# Altium project PCB_Project1.PrjPCB
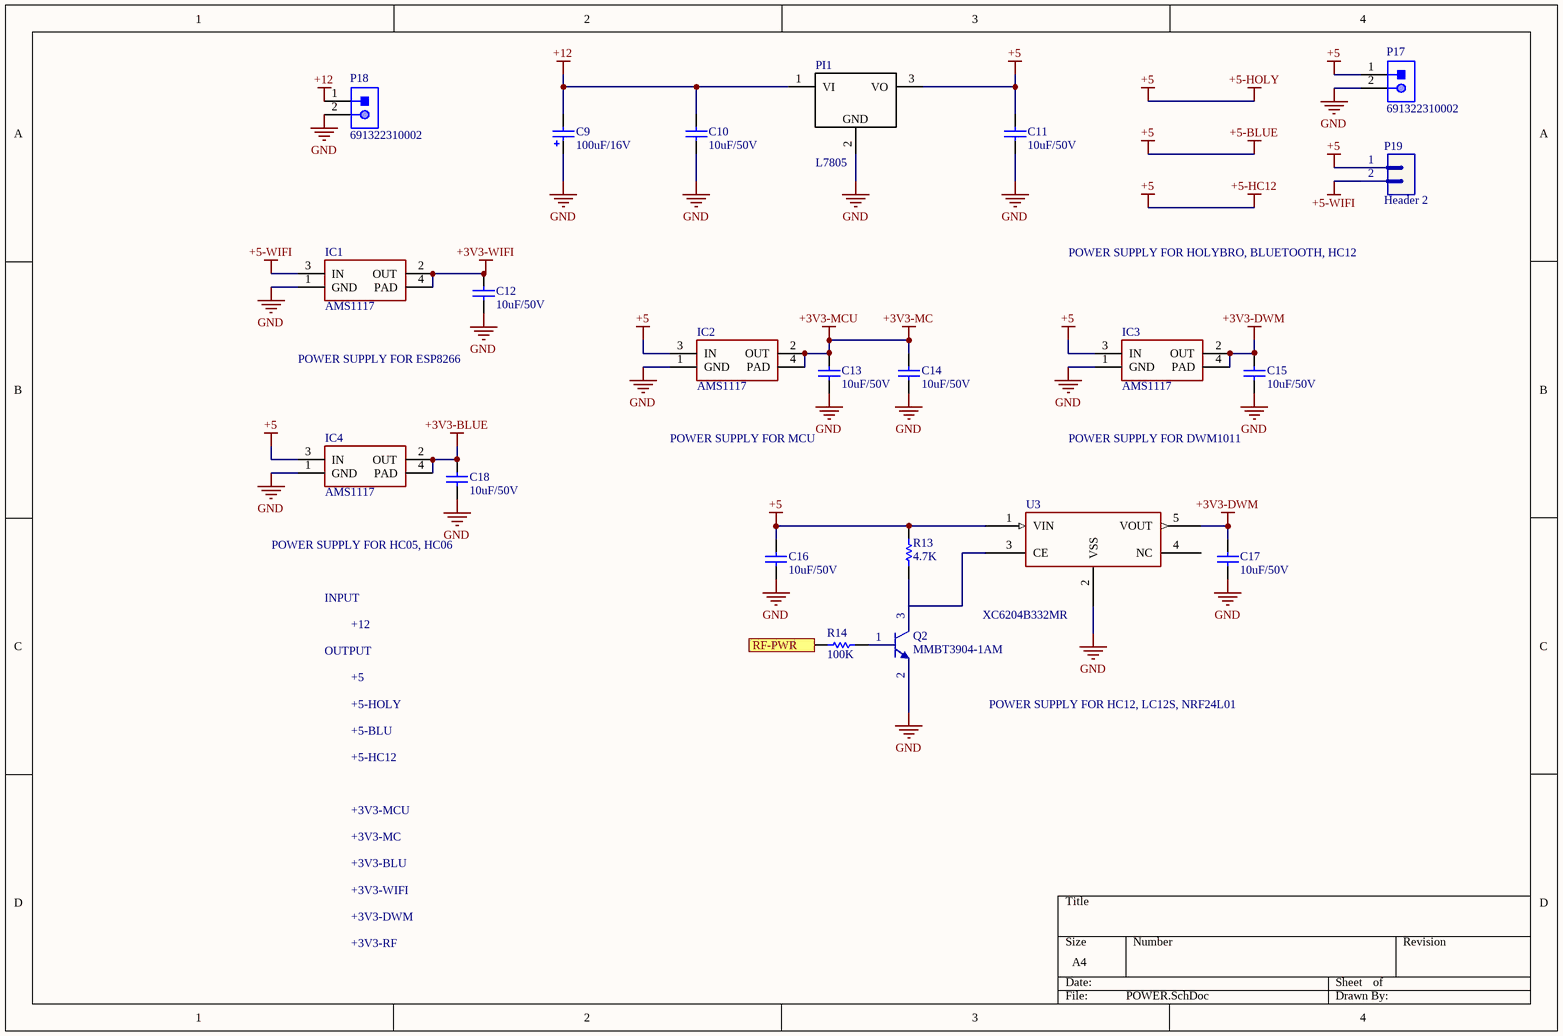
[diagram p0: POWER.SchDoc]
4 sheets, 76 parts. Net scope: flat (ports and power ports of the same name join across sheets).
Sheets:
  POWER.SchDoc
  MCU.SchDoc
  SENSOR.SchDoc
  MOTOR CONTROL.SchDoc

## Sheet POWER.SchDoc
size A4

### Parts
C9  value 100uF/16V  [CAP-SM-AL-SIZE-D-D6L6]  (hidden comment: Cap-Al-100uF-16V-D6L5)
C10  value 10uF/50V  [CAP-SM-0805]  (hidden comment: Cap-10uF-50V-0805)
C11  value 10uF/50V  [CAP-SM-0805]  (hidden comment: Cap-10uF-50V-0805)
C12  value 10uF/50V  [CAP-SM-0805]  (hidden comment: Cap-10uF-50V-0805)
C13  value 10uF/50V  [CAP-SM-0805]  (hidden comment: Cap-10uF-50V-0805)
C14  value 10uF/50V  [CAP-SM-0805]  (hidden comment: Cap-10uF-50V-0805)
C15  value 10uF/50V  [CAP-SM-0805]  (hidden comment: Cap-10uF-50V-0805)
C16  value 10uF/50V  [CAP-SM-0805]  (hidden comment: Cap-10uF-50V-0805)
C17  value 10uF/50V  [CAP-SM-0805]  (hidden comment: Cap-10uF-50V-0805)
C18  value 10uF/50V  [CAP-SM-0805]  (hidden comment: Cap-10uF-50V-0805)
IC1  AMS1117  [SOT223]
IC2  AMS1117  [SOT223]
IC3  AMS1117  [SOT223]
IC4  AMS1117  [SOT223]
P17  691322310002  [691322310002]
P18  691322310002  [691322310002]
P19  Header 2  [JP2]
PI1  L7805  [D2PAK]
Q2  MMBT3904-1AM  [SOT23_NEX]
R13  value 4.7K  [RES-SM-0805]  (hidden comment: Res-4.7K-0805)
R14  value 100K  [RES-SM-0805]  (hidden comment: Res-100K-0805)
U3  XC6204B332MR  [XC6204/05_SOT-00]

### Ports
RF-PWR (in)

### Nets
+3V3-BLUE: C18.2 IC4.2(OUT) IC4.4(PAD)
+3V3-DWM: C15.2 C17.2 IC3.2(OUT) IC3.4(PAD) U3.5(VOUT)
+3V3-MC: C13.2 C14.2 IC2.2(OUT) IC2.4(PAD)  [also labelled +3V3-MCU]
+3V3-WIFI: C12.2 IC1.2(OUT) IC1.4(PAD)
+5: C11.2 C16.2 IC2.3(IN) IC3.3(IN) IC4.3(IN) P17.1 P19.1 PI1.3(VO) R13.2 U3.1(VIN)  [also labelled +5-BLUE, +5-HC12, +5-HOLY]
+5-WIFI: IC1.3(IN) P19.2
+12: C9.2 C10.2 P18.1 PI1.1(VI)
GND: C9.1 C10.1 C11.1 C12.1 C13.1 C14.1 C15.1 C16.1 C17.1 C18.1 IC1.1(GND) IC2.1(GND) IC3.1(GND) IC4.1(GND) P17.2 P18.2 PI1.2 Q2.2(E) U3.2(VSS)
NetQ2_1: Q2.1(B) R14.2
NetQ2_3: Q2.3(C) R13.1
NetR14_1: R14.1 ; port RF-PWR

Not connected (* = marked no-connect by the designer): U3 3(CE) 4(NC)

### Notes on the sheet
- POWER SUPPLY FOR HOLYBRO, BLUETOOTH, HC12
- POWER SUPPLY FOR ESP8266
- POWER SUPPLY FOR MCU
- POWER SUPPLY FOR DWM1011
- POWER SUPPLY FOR HC05, HC06
- INPUT
- OUTPUT
- +12
- +5
- +5-HOLY
- POWER SUPPLY FOR HC12, LC12S, NRF24L01
- +5-BLU
- +5-HC12
- +3V3-MC
- +3V3-MCU
- +3V3-BLU
- +3V3-DWM
- +3V3-WIFI
- +3V3-RF
- (in symbol L7805-D2PAK) GND

### Library data of the parts
C9 = Cap-Al-100uF-16V-D6L5: CAP ALUM 100UF 20% 16V SMD; Manufacturer: Nichicon; Manufacturer Part Number: UWX1C101MCL1GB; Local Supplier: thegioiic; Local Supplier Link: https://thegioiic.com/products/tu-nhom-smd-100uf-16v-d6-3l5-4; Supplier 1: Digikey; Supplier 1 Part Number: 493-2105-1-ND; Supplier 1 Link: https://www.digikey.com/product-detail/en/nichicon/UWX1C101MCL1GB/493-2105-1-ND/590080
C10-C18 = Cap-10uF-50V-0805: CAP CER 10UF 50V X5R 0805; Manufacturer: Yageo; Manufacturer Part Number: CC0805KKX5R9BB106; Local Supplier: thegioiic; Local Supplier Link: https://thegioiic.com/products/tu-10uf-50v-0805; Supplier 1: Digikey; Supplier 1 Link: https://www.digikey.com/product-detail/en/yageo/CC0805KKX5R9BB106/311-3499-2-ND/7164383; Supplier 1 Part Number: 311-3499-2-ND
IC1-IC4 = AMS1117: Available in 1.8V, 2.5V, 2.85V, 3.3V, 5V, and  Adjustable Versions; Value: LM317
P17 P18 = 691322310002: WR-TBL Serie 322 Horizontal PCB Header, Pluggable, pitch 3.81mm, 2p; Compliance: RoHS; Modularity: No; Pin Number: 2; Rated Current [UL]: 10A; Working Voltage [UL]: 300VAC; ComponentLink1Description: Manufacturer; ComponentLink1URL: http://www.we-online.de; ComponentLink2URL: https://katalog.we-online.de/em/datasheet/691322310002.pdf; ComponentLink2Description: Datasheet; Mounting Technology: THT; Part Number: 691322310002; Packaging: Box; Operating Temperature: -40 to +105degC; PCB/Cable/Panel: PCB; Pitch: 3.81mm; Published Date: October 2019; Type: Horizontal; Publisher: Wurth Elektronik; Application: Pluggable
P19 = Header 2: Header, 2-Pin; LatestRevisionDate: 17-Jul-2002; LatestRevisionNote: Re-released for DXP Platform.; Publisher: Altium Limited
PI1 = L7805-D2PAK: LINEAR REGULATOR 5.0V; Supplier 1: Digi-Key; Supplier Part Number 1: 497-1170-6-ND
R13 = Res-4.7K-0805: RES SMD 4.7K OHM 5% 1/8W 0805; Manufacturer: Yageo; Manufacturer Part Number: RC0805JR-074K7L; Local Supplier: thegioiic; Local Supplier Link: https://thegioiic.com/products/dien-tro-4-7k-ohm-0805-5; Supplier 1: Digikey; Supplier 1 Link: https://www.digikey.com/product-detail/en/yageo/RC0805JR-074K7L/311-4.7KARCT-ND/731274; Supplier 1 Part Number: 311-4.7KARCT-ND
R14 = Res-100K-0805: RES 0 OHM JUMPER 0805; Manufacturer: Vishay Dale; Manufacturer Part Number: WSL080500000ZEA9; Local Supplier: thegioiic; Local Supplier Link: https://thegioiic.com/products/dien-tro-0-ohm-0805-5; Supplier 1: Digikey; Supplier 1 Link: https://www.digikey.com/product-detail/en/vishay-dale/WSL080500000ZEA9/541-3928-1-ND/7423223; Supplier 1 Part Number: 541-3928-1-ND
U3 = XC6204B332MR: Vendor: Torex Semiconductor; Built_By: EMA_UL_Team; SourceLibrary: Torex_2016-07-05_1; Manufacturer_Part_Number: XC6204B332MR; Copyright: Copyright (C) 2018 Accelerated Designs. All rights reserved; RefDes: RefDes; Type: DEV

## Sheet MCU.SchDoc
size A4
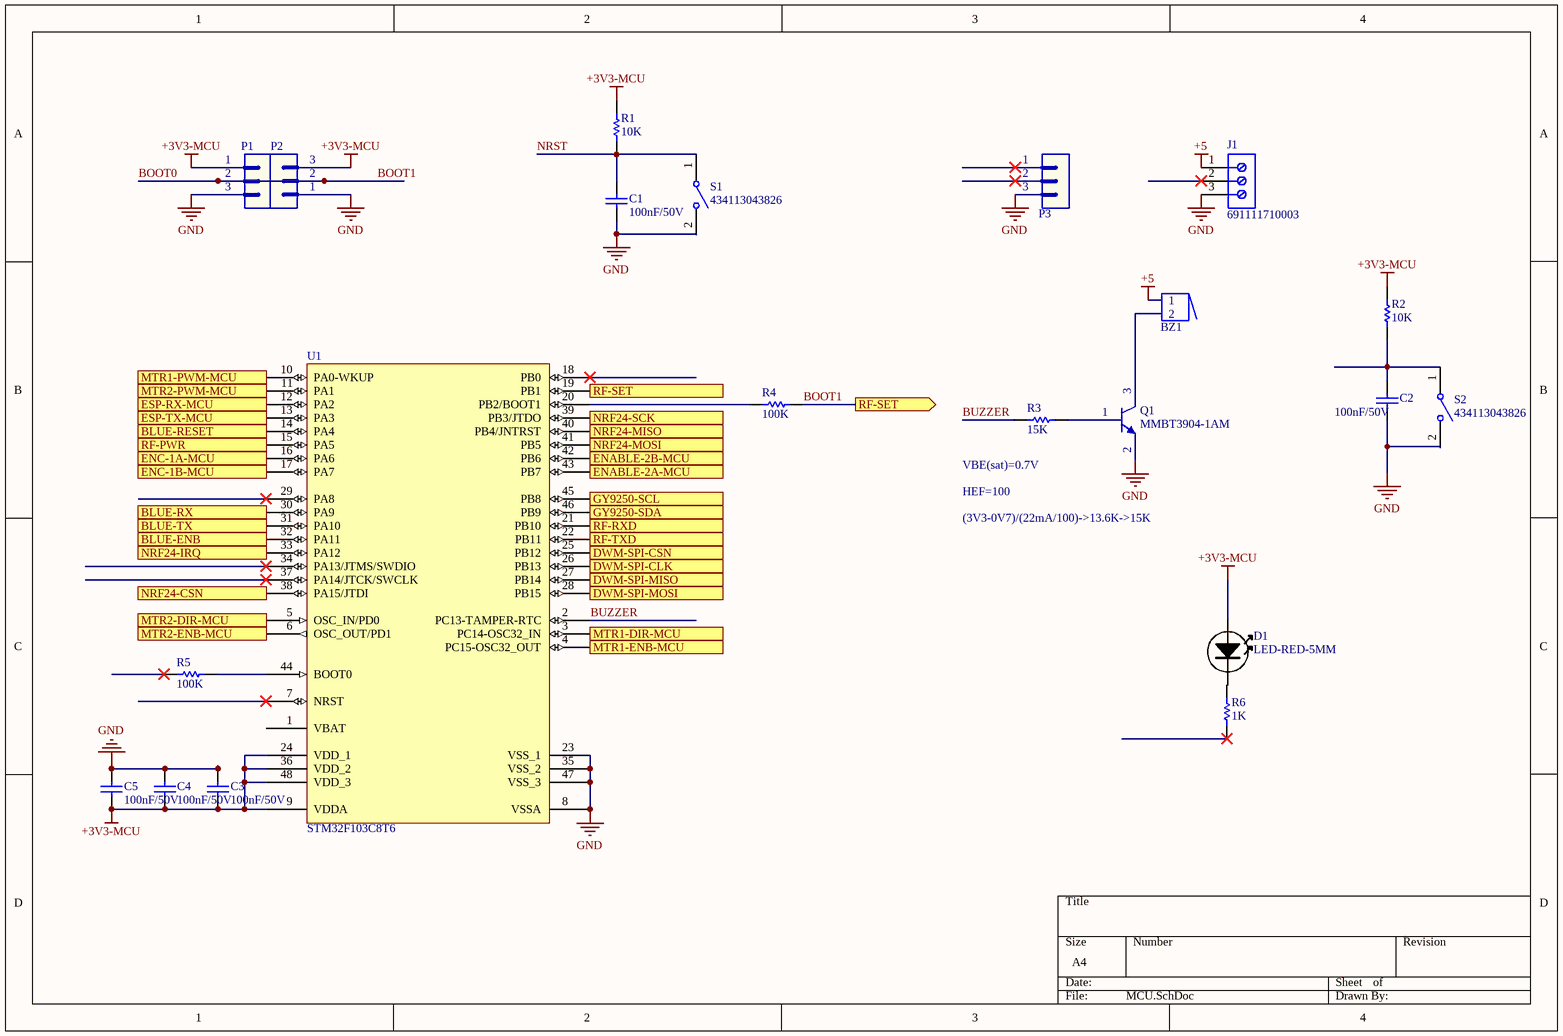
[diagram p1: MCU.SchDoc]

### Parts
BZ1  Buzzer  [BUZZER]  (value not drawn)
C1  value 100nF/50V  [CAP-SM-0805]  (hidden comment: Cap-100nF-50V-0805)
C2  value 100nF/50V  [CAP-SM-0805]  (hidden comment: Cap-100nF-50V-0805)
C3  value 100nF/50V  [CAP-SM-0805]  (hidden comment: Cap-100nF-50V-0805)
C4  value 100nF/50V  [CAP-SM-0805]  (hidden comment: Cap-100nF-50V-0805)
C5  value 100nF/50V  [CAP-SM-0805]  (hidden comment: Cap-100nF-50V-0805)
D1  LED-RED-5MM  [LED-5MM-RED]
J1  691111710003  [691111710003]
P1  Header 3  [JP3]  (value not drawn)
P2  Header 3  [JP3]  (value not drawn)
P3  Header 3  [JP3]  (value not drawn)
Q1  MMBT3904-1AM  [SOT23_NEX]
R1  value 10K  [RES-SM-0805]  (hidden comment: Res-10k-0805)
R2  value 10K  [RES-SM-0805]  (hidden comment: Res-10k-0805)
R3  value 15K  [RES-SM-0805]  (hidden comment: Res-15K-0805)
R4  value 100K  [RES-SM-0805]  (hidden comment: Res-100K-0805)
R5  value 100K  [RES-SM-0805]  (hidden comment: Res-100K-0805)
R6  value 1K  [RES-SM-0805]  (hidden comment: Res-1K-0805)
S1  434113043826  [434113043826]
S2  434113043826  [434113043826]
U1  STM32F103C8T6  [LQFP48_N]

### Ports
BLUE-ENB (out), BLUE-RESET (out), BLUE-RX (out), BLUE-TX (in), DWM-SPI-CLK (out), DWM-SPI-CSN (out), DWM-SPI-MISO (in), DWM-SPI-MOSI (out), ENABLE-2A-MCU (in), ENABLE-2B-MCU (in), ENC-1A-MCU (in), ENC-1B-MCU (in), ESP-RX-MCU (out), ESP-TX-MCU (in), GY9250-SCL (out), GY9250-SDA (out), MTR1-DIR-MCU (out), MTR1-ENB-MCU (out), MTR1-PWM-MCU (out), MTR2-DIR-MCU (out), MTR2-ENB-MCU (out), MTR2-PWM-MCU (out), NRF24-CSN (out), NRF24-IRQ (in), NRF24-MISO (in), NRF24-MOSI (out), NRF24-SCK (out), RF-PWR (out), RF-RXD (out), RF-SET (out), RF-TXD (in)

### Nets
+3V3-MCU: C3.1 C4.1 C5.1 D1.A P1.1 P2.3 R1.2 R2.2 U1.9(VDDA) U1.24(VDD_1) U1.36(VDD_2) U1.48(VDD_3)  [project net +3V3-MC]
+5: BZ1.1 J1.1
GND: C1.1 C2.2 C3.2 C4.2 C5.2 J1.3 P1.3 P2.1 P3.3 Q1.2(E) S1.2 S2.2 U1.8(VSSA) U1.23(VSS_1) U1.35(VSS_2) U1.47(VSS_3)
BOOT0: P1.2 P2.2 R4.2 U1.19(PB1) ; port RF-SET  [also labelled BOOT1]
BUZZER: R3.1 U1.2(PC13-TAMPER-RTC)
NRST: C1.2 R1.1 S1.1
NetBZ1_2: BZ1.2 Q1.3(C)
NetC2_1: C2.1 R2.1 S2.1
NetM3_3: U1.45(PB8) ; port GY9250-SCL
NetM3_4: U1.46(PB9) ; port GY9250-SDA
NetQ1_1: Q1.1(B) R3.2
NetR4_1: R4.1 U1.20(PB2/BOOT1)
NetR5_2: R5.2 U1.44(BOOT0)
NetR14_1: U1.15(PA5) ; port RF-PWR
NetU1_3: U1.3(PC14-OSC32_IN) ; port MTR1-DIR-MCU
NetU1_4: U1.4(PC15-OSC32_OUT) ; port MTR1-ENB-MCU
NetU1_5: U1.5(OSC_IN/PD0) ; port MTR2-DIR-MCU
NetU1_6: U1.6(OSC_OUT/PD1) ; port MTR2-ENB-MCU
NetU1_10: U1.10(PA0-WKUP) ; port MTR1-PWM-MCU
NetU1_11: U1.11(PA1) ; port MTR2-PWM-MCU
NetU1_12: U1.12(PA2) ; port ESP-RX-MCU
NetU1_13: U1.13(PA3) ; port ESP-TX-MCU
NetU1_14: U1.14(PA4) ; port BLUE-RESET
NetU1_16: U1.16(PA6) ; port ENC-1A-MCU
NetU1_17: U1.17(PA7) ; port ENC-1B-MCU
NetU1_21: U1.21(PB10) ; port RF-RXD
NetU1_22: U1.22(PB11) ; port RF-TXD
NetU1_25: U1.25(PB12) ; port DWM-SPI-CSN
NetU1_26: U1.26(PB13) ; port DWM-SPI-CLK
NetU1_27: U1.27(PB14) ; port DWM-SPI-MISO
NetU1_28: U1.28(PB15) ; port DWM-SPI-MOSI
NetU1_30: U1.30(PA9) ; port BLUE-RX
NetU1_31: U1.31(PA10) ; port BLUE-TX
NetU1_32: U1.32(PA11) ; port BLUE-ENB
NetU1_33: U1.33(PA12) ; port NRF24-IRQ
NetU1_38: U1.38(PA15/JTDI) ; port NRF24-CSN
NetU1_39: U1.39(PB3/JTDO) ; port NRF24-SCK
NetU1_40: U1.40(PB4/JNTRST) ; port NRF24-MISO
NetU1_41: U1.41(PB5) ; port NRF24-MOSI
NetU1_42: U1.42(PB6) ; port ENABLE-2B-MCU
NetU1_43: U1.43(PB7) ; port ENABLE-2A-MCU

Not connected (* = marked no-connect by the designer): D1 K; J1 2*; P3 1* 2*; R5 1*; R6 1* 2; U1 1(VBAT) 7(NRST)* 18(PB0)* 29(PA8)* 34(PA13/JTMS/SWDIO)* 37(PA14/JTCK/SWCLK)*

### Notes on the sheet
- (near R3) VBE(sat)=0.7V
- HEF=100
- (3V3-0V7)/(22mA/100)->13.6K->15K

### Library data of the parts
C1-C5 = Cap-100nF-50V-0805: CAP CER 0.1UF 50V Y5V 0805; Manufacturer: Samsung Electro-Mechanics; Manufacturer Part Number: CL21F104ZBCNNNC; Local Supplier: thegioiic; Local Supplier Link: https://thegioiic.com/products/tu-100nf-0-1uf-50v-0805; Supplier 1: Digikey; Supplier 1 Part Number: 1276-1007-1-ND; Supplier 1 Link: https://www.digikey.com/product-detail/en/samsung-electro-mechanics/CL21F104ZBCNNNC/1276-1007-1-ND/3889093
J1 = 691111710003: WR-TBL Serie 111 Horizontal Entry Modular, Pressure Clamp, pitch 5mm, 3p; Compliance: Lead free / RoHS; Modularity: Yes; PCB/Cable/Panel: PCB; Pin Number: 3; Rated Current [UL]: 15A; Working Voltage [UL]: 250VAC; ComponentLink1Description: Manufacturer; ComponentLink1URL: http://www.we-online.de; ComponentLink2URL: https://katalog.we-online.de/em/datasheet/691111710003.pdf; ComponentLink2Description: Datasheet; Mounting Technology: THT; Part Number: 691111710003; Packaging: Box; Operating Temperature: -40 to +105degC; Pitch: 5mm; Published Date: October 2019; Type: Horizontal; Publisher: Wurth Elektronik; Application: Pressure Clamp
P1-P3 = Header 3: Header, 3-Pin; LatestRevisionDate: 17-Jul-2002; LatestRevisionNote: Re-released for DXP Platform.; Publisher: Altium Limited
R1 R2 = Res-10k-0805: RES 10K OHM 1% 1/4W 0805; Manufacturer: Stackpole Electronics Inc; Manufacturer Part Number: RNCP0805FTD10K0; Local Supplier: thegioiic; Local Supplier Link: https://thegioiic.com/products/dien-tro-10k-ohm-0805-5; Supplier 1: Digikey; Supplier 1 Link: https://www.digikey.com/product-detail/en/stackpole-electronics-inc/RNCP0805FTD10K0/RNCP0805FTD10K0CT-ND/2240601; Supplier 1 Part Number: RNCP0805FTD10K0CT-ND
R3 = Res-15K-0805: RES 15K OHM 1% 1/4W 0805; Manufacturer: TE Connectivity Passive Product; Manufacturer Part Number: CRGCQ0805F15K; Local Supplier: thegioiic; Local Supplier Link: https://thegioiic.com/products/dien-tro-15k-ohm-0805-1; Supplier 1: Digikey; Supplier 1 Part Number: A129763CT-ND; Supplier 1 Link: https://www.digikey.com/product-detail/en/te-connectivity-passive-product/CRGCQ0805F15K/A129763CT-ND/8577595
R4 R5 = Res-100K-0805: as R14 on sheet POWER; Local Supplier: thegioiic; Local Supplier Link: https://thegioiic.com/products/dien-tro-0-ohm-0805-5; Supplier 1: Digikey; Supplier 1 Link: https://www.digikey.com/product-detail/en/vishay-dale/WSL080500000ZEA9/541-3928-1-ND/7423223; Supplier 1 Part Number: 541-3928-1-ND
R6 = Res-1K-0805: RES 1K OHM 1% 1/4W 0805; Manufacturer: Stackpole Electronics Inc; Manufacturer Part Number: RNCP0805FTD1K00; Local Supplier: thegioiic; Local Supplier Link: https://thegioiic.com/products/dien-tro-1k-ohm-0805-5; Supplier 1: Digikey; Supplier 1 Link: https://www.digikey.com/product-detail/en/stackpole-electronics-inc/RNCP0805FTD1K00/RNCP0805FTD1K00CT-ND/2240568; Supplier 1 Part Number: RNCP0805FTD1K00CT-ND
S1 S2 = 434113043826: WS-TASV J-Bend SMT Tact Switch 6x3.5mm, height 4.3mm, 260gf; Rated Voltage: 12VDC; Rated Current: 50mA; Washable: No; ComponentLink1Description: Manufacturer; ComponentLink1URL: http://www.we-online.de; ComponentLink2Description: Datasheet; ComponentLink2URL: https://katalog.we-online.com/em/datasheet/434113043826.pdf; Operating Temperature: -40 to +85degC; Part Number: 434113043826; Published Date: September 2019; Contact Material: Stainless Steel; Height: 4.3mm; Mounting Technology: SMT; Contact Plating: Silver; Operation Force: 260gf; Packaging: Tape and Reel; Terminal Material: Copper Alloy; Publisher: Wurth Elektronik; Terminal Plating: Silver
U1 = STM32F103C8T6: STM32 ARM-based 32-bit MCU with 64 Kbytes Flash, 48-pin LQFP, Industrial Temperature; Published: 30-May-2008; DatasheetVersion: rev6, Mar-2008; PackageVersion: Mar-2008; PackageReference: LQFP48; Publisher: Altium Limited; PackageDescription: 48-Pin Low-Profile Quad Flat Pack, 7 x 7 mm Body, 0.5 mm Pitch (LQFP48); ComponentLink1Description: Manufacturer Link; ComponentLink1URL: www.st.com/stm32; ComponentLink2Description: Datasheet; ComponentLink2URL: http://www.st.com/stonline/products/literature/ds/13587.pdf

## Sheet SENSOR.SchDoc
size A4
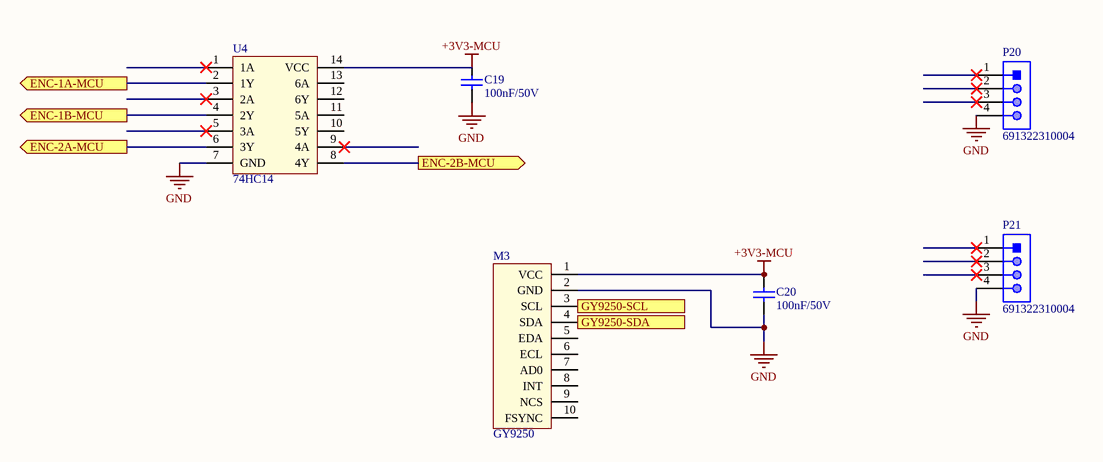
[diagram p2: SENSOR.SchDoc]

### Parts
C19  value 100nF/50V  [CAP-SM-0805]  (hidden comment: Cap-100nF-50V-0805)
C20  value 100nF/50V  [CAP-SM-0805]  (hidden comment: Cap-100nF-50V-0805)
M3  GY9250  [GY9250]
P20  691322310004  [691322310004]
P21  691322310004  [691322310004]
U4  74HC14  [74HC14D,652]

### Ports
ENC-1A-MCU (out), ENC-1B-MCU (out), ENC-2A-MCU (out), ENC-2B-MCU (out), GY9250-SCL, GY9250-SDA

### Nets
+3V3-MCU: C20.2 M3.1(VCC) U4.14(VCC)  [project net +3V3-MC]
GND: C19.1 C20.1 M3.2(GND) P20.4 P21.4 U4.7(GND)
NetM3_3: M3.3(SCL) ; port GY9250-SCL
NetM3_4: M3.4(SDA) ; port GY9250-SDA
NetU1_16: U4.2(1Y) ; port ENC-1A-MCU
NetU1_17: U4.4(2Y) ; port ENC-1B-MCU
NetU4_6: U4.6(3Y) ; port ENC-2A-MCU
NetU4_8: U4.8(4Y) ; port ENC-2B-MCU

Not connected (* = marked no-connect by the designer): C19 2; M3 5(EDA) 6(ECL) 7(AD0) 8(INT) 9(NCS) 10(FSYNC); P20 1* 2* 3*; P21 1* 2* 3*; U4 1(1A)* 3(2A)* 5(3A)* 9(4A)* 10(5Y) 11(5A) 12(6Y) 13(6A)

### Library data of the parts
C19 C20 = Cap-100nF-50V-0805: as C1 on sheet MCU; Local Supplier: thegioiic; Local Supplier Link: https://thegioiic.com/products/tu-100nf-0-1uf-50v-0805; Supplier 1: Digikey; Supplier 1 Part Number: 1276-1007-1-ND; Supplier 1 Link: https://www.digikey.com/product-detail/en/samsung-electro-mechanics/CL21F104ZBCNNNC/1276-1007-1-ND/3889093
P20 P21 = 691322310004: WR-TBL Serie 322 Horizontal PCB Header, Pluggable, pitch 3.81mm, 4p; Compliance: RoHS; Modularity: No; Pin Number: 4; Rated Current [UL]: 10A; Working Voltage [UL]: 300VAC; ComponentLink1Description: Manufacturer; ComponentLink1URL: http://www.we-online.de; ComponentLink2URL: https://katalog.we-online.de/em/datasheet/691322310004.pdf; ComponentLink2Description: Datasheet; Mounting Technology: THT; Part Number: 691322310004; Packaging: Box; Operating Temperature: -40 to +105degC; PCB/Cable/Panel: PCB; Pitch: 3.81mm; Published Date: October 2019; Type: Horizontal; Publisher: Wurth Elektronik; Application: Pluggable

## Sheet MOTOR CONTROL.SchDoc
size A4
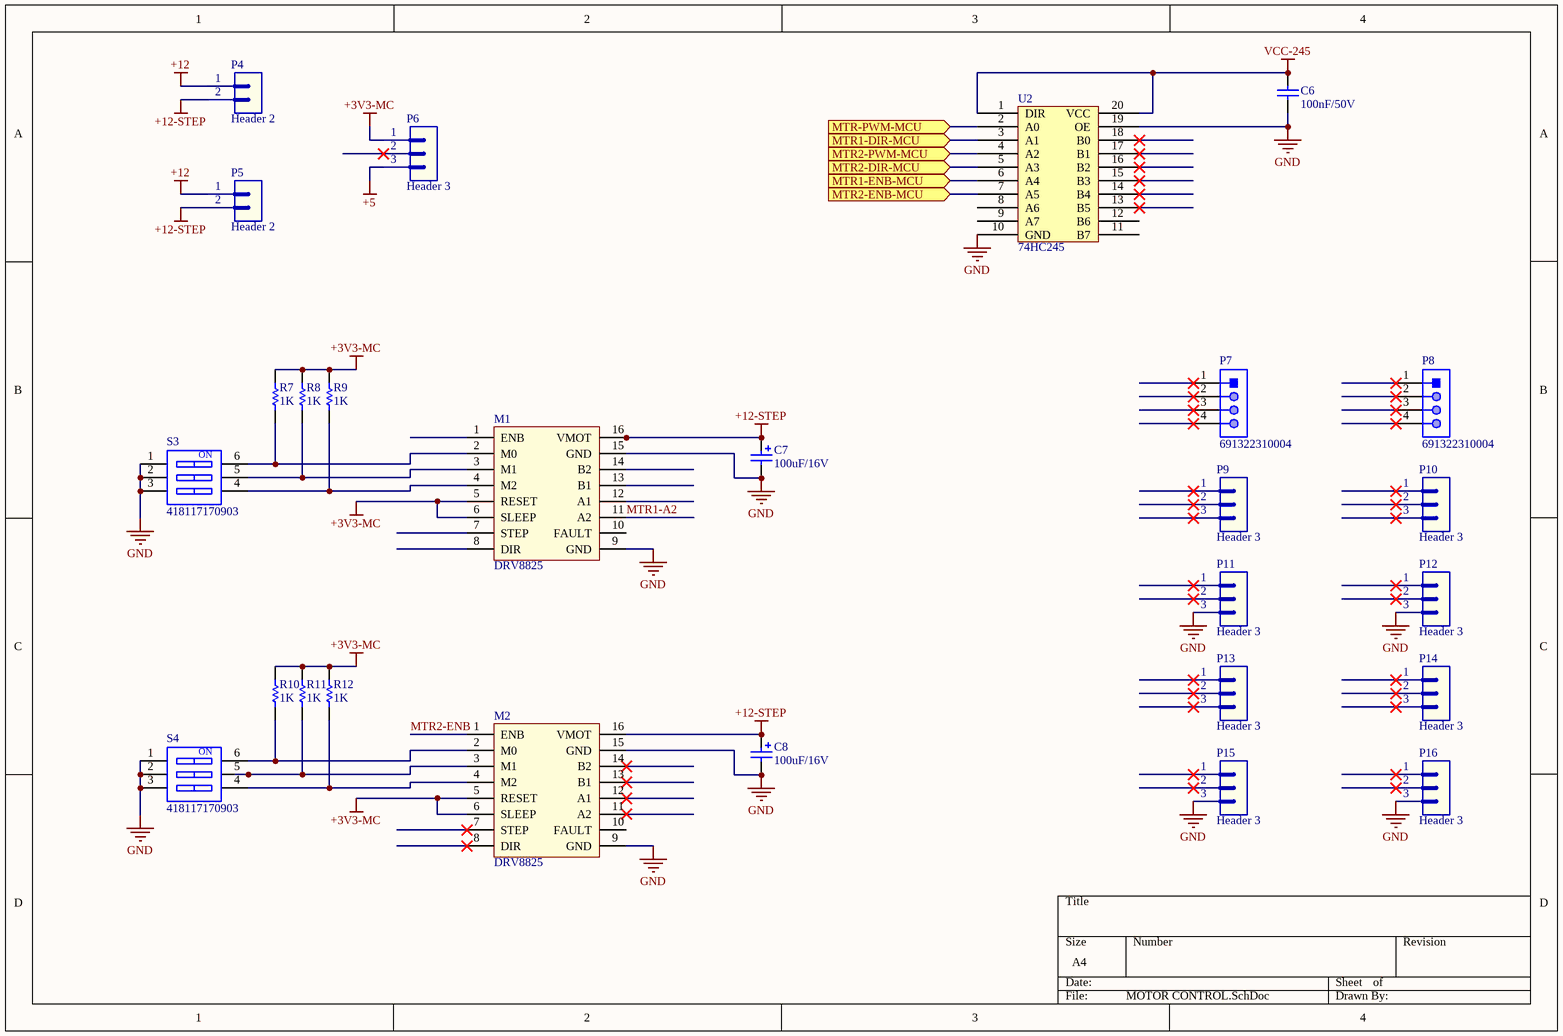
[diagram p3: MOTOR CONTROL.SchDoc]

### Parts
C6  value 100nF/50V  [CAP-SM-0805]  (hidden comment: Cap-100nF-50V-0805)
C7  value 100uF/16V  [CAP-SM-AL-SIZE-D-D6L6]  (hidden comment: Cap-Al-100uF-16V-D6L5)
C8  value 100uF/16V  [CAP-SM-AL-SIZE-D-D6L6]  (hidden comment: Cap-Al-100uF-16V-D6L5)
M1  DRV8825
M2  DRV8825
P4  Header 2  [JP2]
P5  Header 2  [JP2]
P6  Header 3  [JP3]
P7  691322310004  [691322310004]
P8  691322310004  [691322310004]
P9  Header 3  [JP3]
P10  Header 3  [JP3]
P11  Header 3  [JP3]
P12  Header 3  [JP3]
P13  Header 3  [JP3]
P14  Header 3  [JP3]
P15  Header 3  [JP3]
P16  Header 3  [JP3]
R7  value 1K  [RES-SM-0805]  (hidden comment: Res-1K-0805)
R8  value 1K  [RES-SM-0805]  (hidden comment: Res-1K-0805)
R9  value 1K  [RES-SM-0805]  (hidden comment: Res-1K-0805)
R10  value 1K  [RES-SM-0805]  (hidden comment: Res-1K-0805)
R11  value 1K  [RES-SM-0805]  (hidden comment: Res-1K-0805)
R12  value 1K  [RES-SM-0805]  (hidden comment: Res-1K-0805)
S3  418117170903  [418117170903]
S4  418117170903  [418117170903]
U2  74HC245  [DIP20/W0.3]

### Ports
MTR1-DIR-MCU (in), MTR1-ENB-MCU (in), MTR2-DIR-MCU (in), MTR2-ENB-MCU (in), MTR2-PWM-MCU (in), MTR-PWM-MCU (in)

### Nets
+3V3-MC: M1.5(RESET) M1.6(SLEEP) M2.5(RESET) M2.6(SLEEP) P6.1 R7.2 R8.2 R9.2 R10.2 R11.2 R12.2
+5: P6.3
+12: P4.1 P5.1
+12-STEP: C7.1 C8.1 M1.16(VMOT) M2.16(VMOT) P4.2 P5.2
GND: C6.1 C7.2 C8.2 M1.9(GND) M1.15(GND) M2.9(GND) M2.15(GND) P11.3 P12.3 P15.3 P16.3 S3.1 S3.2 S3.3 S4.1 S4.2 S4.3 U2.10(GND) U2.19(OE)
VCC-245: C6.2 U2.1(DIR) U2.20(VCC)
MTR1-A2: M1.11(A2)
MTR2-ENB: M2.1(ENB)
NetM1_2: M1.2(M0) R7.1 S3.6
NetM1_3: M1.3(M1) R8.1 S3.5
NetM1_4: M1.4(M2) R9.1 S3.4
NetM2_2: M2.2(M0) R10.1 S4.6
NetM2_3: M2.3(M1) R11.1 S4.5
NetM2_4: M2.4(M2) R12.1 S4.4
NetU1_3: U2.3(A1) ; port MTR1-DIR-MCU
NetU1_4: U2.6(A4) ; port MTR1-ENB-MCU
NetU1_5: U2.5(A3) ; port MTR2-DIR-MCU
NetU1_6: U2.7(A5) ; port MTR2-ENB-MCU
NetU1_11: U2.4(A2) ; port MTR2-PWM-MCU
NetU2_2: U2.2(A0) ; port MTR-PWM-MCU

Not connected (* = marked no-connect by the designer): M1 1(ENB) 7(STEP) 8(DIR) 10(FAULT) 12(A1) 13(B1) 14(B2); M2 7(STEP)* 8(DIR)* 10(FAULT) 11(A2)* 12(A1)* 13(B1)* 14(B2)*; P6 2*; P7 1* 2* 3* 4*; P8 1* 2* 3* 4*; P9 1* 2* 3*; P10 1* 2* 3*; P11 1* 2*; P12 1* 2*; P13 1* 2* 3*; P14 1* 2* 3*; P15 1* 2*; P16 1* 2*; U2 8(A6) 9(A7) 11(B7) 12(B6) 13(B5)* 14(B4)* 15(B3)* 16(B2)* 17(B1)* 18(B0)*

### Notes on the sheet
- (in symbol 418117170903) ON

### Library data of the parts
C6 = Cap-100nF-50V-0805: as C1 on sheet MCU; Local Supplier: thegioiic; Local Supplier Link: https://thegioiic.com/products/tu-100nf-0-1uf-50v-0805; Supplier 1: Digikey; Supplier 1 Part Number: 1276-1007-1-ND; Supplier 1 Link: https://www.digikey.com/product-detail/en/samsung-electro-mechanics/CL21F104ZBCNNNC/1276-1007-1-ND/3889093
C7 C8 = Cap-Al-100uF-16V-D6L5: as C9 on sheet POWER; Local Supplier: thegioiic; Local Supplier Link: https://thegioiic.com/products/tu-nhom-smd-100uf-16v-d6-3l5-4; Supplier 1: Digikey; Supplier 1 Part Number: 493-2105-1-ND; Supplier 1 Link: https://www.digikey.com/product-detail/en/nichicon/UWX1C101MCL1GB/493-2105-1-ND/590080
P4 P5 = Header 2: Header, 2-Pin; LatestRevisionDate: 17-Jul-2002; LatestRevisionNote: Re-released for DXP Platform.; Publisher: Altium Limited
P6 P9-P16 = Header 3: Header, 3-Pin; LatestRevisionDate: 17-Jul-2002; LatestRevisionNote: Re-released for DXP Platform.; Publisher: Altium Limited
P7 P8 = 691322310004: as P20 on sheet SENSOR; ComponentLink1Description: Manufacturer; ComponentLink1URL: http://www.we-online.de; ComponentLink2URL: https://katalog.we-online.de/em/datasheet/691322310004.pdf; ComponentLink2Description: Datasheet; Mounting Technology: THT; Part Number: 691322310004; Packaging: Box; Operating Temperature: -40 to +105degC; PCB/Cable/Panel: PCB; Pitch: 3.81mm; Published Date: October 2019; Type: Horizontal; Publisher: Wurth Elektronik; Application: Pluggable
R7-R12 = Res-1K-0805: as R6 on sheet MCU; Local Supplier: thegioiic; Local Supplier Link: https://thegioiic.com/products/dien-tro-1k-ohm-0805-5; Supplier 1: Digikey; Supplier 1 Link: https://www.digikey.com/product-detail/en/stackpole-electronics-inc/RNCP0805FTD1K00/RNCP0805FTD1K00CT-ND/2240568; Supplier 1 Part Number: RNCP0805FTD1K00CT-ND
S3 S4 = 418117170903: WS-DITV Compact THT Dip Switch, Flat Actuator, pitch 2.54mm, 3p; Operation Force: 800g; Pole Number: 3; Actuator Type: Flat Type; Circuit: SPST-NO; Rated Current Switching: 25mA; Rated Current Non-Switching: 100mA; Rated Voltage Non-Switching: 50VDC; Rated Voltage Switching: 24VDC; ComponentLink1Description: Manufacturer; ComponentLink1URL: http://www.we-online.de; ComponentLink2Description: Datasheet; ComponentLink2URL: https://katalog.we-online.com/em/datasheet/418117170903.pdf; Pitch: 2.54mm; Contact Material: Copper Alloy; Mounting Technology: THT; Operating Temperature: -40 to +85degC; Contact Plating: Gold; Packaging: Tube; Part Number: 418117170903; Publisher: Wurth Elektronik; Published Date: September 2019
U2 = 74HC245: Octal bus tranceiver

## Nets that join several sheets
+3V3-MC: POWER (C13.2 C14.2 IC2.2 IC2.4), MCU (12 pins), SENSOR (C20.2 M3.1 U4.14), MOTOR CONTROL (11 pins)
+5: POWER (10 pins), MCU (BZ1.1 J1.1), MOTOR CONTROL (P6.3)
+12: POWER (C9.2 C10.2 P18.1 PI1.1), MOTOR CONTROL (P4.1 P5.1)
GND: POWER (19 pins), MCU (16 pins), SENSOR (6 pins), MOTOR CONTROL (19 pins)
NetM3_3: MCU (U1.45), SENSOR (M3.3)
NetM3_4: MCU (U1.46), SENSOR (M3.4)
NetR14_1: POWER (R14.1), MCU (U1.15)
NetU1_3: MCU (U1.3), MOTOR CONTROL (U2.3)
NetU1_4: MCU (U1.4), MOTOR CONTROL (U2.6)
NetU1_5: MCU (U1.5), MOTOR CONTROL (U2.5)
NetU1_6: MCU (U1.6), MOTOR CONTROL (U2.7)
NetU1_11: MCU (U1.11), MOTOR CONTROL (U2.4)
NetU1_16: MCU (U1.16), SENSOR (U4.2)
NetU1_17: MCU (U1.17), SENSOR (U4.4)